# EAGLE design schema (EAGLE 6.5.0)
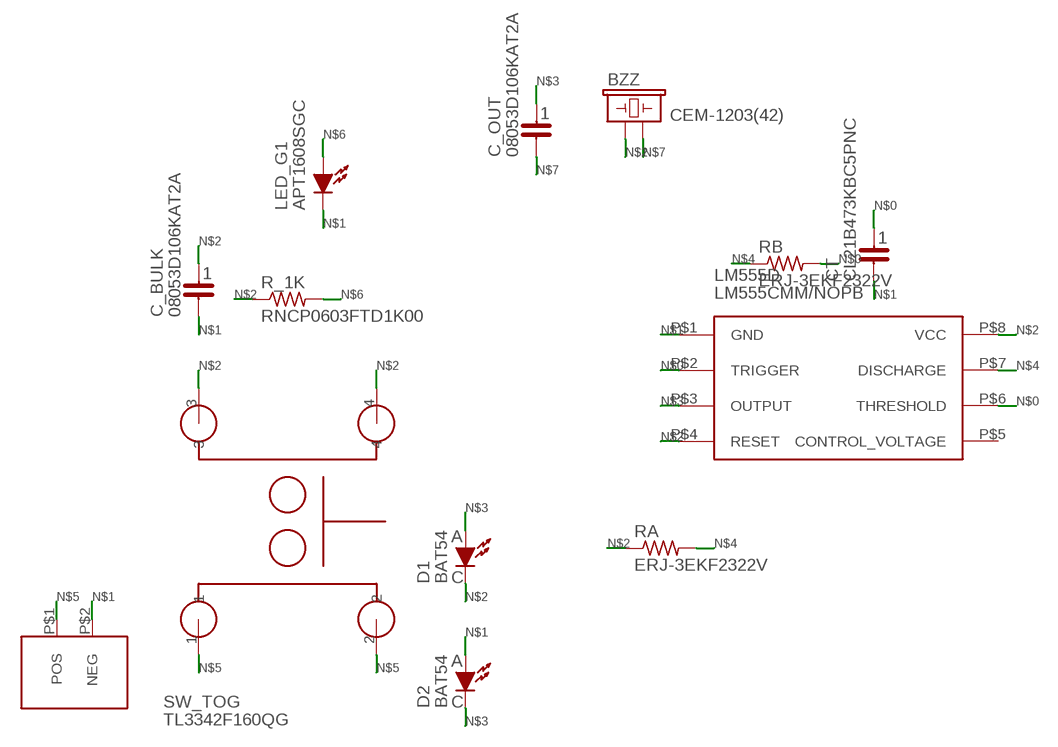
[diagram p0: schematic, sheet 1]

## Parts
BZZ  CEM-1203(42)  BUZZERPTH-KIT  [BUZZER-12MM-KIT]
C_BULK  08053D106KAT2A  C_0805  [C_0805]
C_OUT  08053D106KAT2A  C_0805  [C_0805]
CT  CL21B473KBC5PNC  C_0805  [C_0805]
D1  BAT54  [BAT54]
D2  BAT54  [BAT54]
FID1  FIDUCIAL1MM  [FIDUCIAL_1MM]  (not placed on a sheet)
FID2  FIDUCIAL1MM  [FIDUCIAL_1MM]  (not placed on a sheet)
FID3  FIDUCIAL1MM  [FIDUCIAL_1MM]  (not placed on a sheet)
FID4  FIDUCIAL1MM  [FIDUCIAL_1MM]  (not placed on a sheet)
FID5  FIDUCIAL1MM  [FIDUCIAL_1MM]  (not placed on a sheet)
FID6  FIDUCIAL1MM  [FIDUCIAL_1MM]  (not placed on a sheet)
J1_9V  BS6I  [1X2VIA]
LED_G1  APT1608SGC  LED-0603-KINGBRIGHT  [0603-LED-KINGBRIGHT]
LM555D  LM555CMM/NOPB  [S-PDSO-G8]
R_1K  RNCP0603FTD1K00  RESISTOR_0603  [R_0603]
RA  ERJ-3EKF2322V  RESISTOR_0603  [R_0603]
RB  ERJ-3EKF2322V  RESISTOR_0603  [R_0603]
SW_TOG  TL3342F160QG  [TL3342F160QG]

## Nets
N$0: CT.1 LM555D.P$2(TRIGGER) LM555D.P$6(THRESHOLD) RB.P$2
N$1: C_BULK.2 CT.2 D2.1(A) J1_9V.P$2(NEG) LED_G1.1(C) LM555D.P$1(GND)
N$2: BZZ.+ C_BULK.1 D1.3(C) LM555D.P$4(RESET) LM555D.P$8(VCC) R_1K.P$1 RA.P$1 SW_TOG.3 SW_TOG.4
N$3: C_OUT.1 D1.1(A) D2.3(C) LM555D.P$3(OUTPUT)
N$4: LM555D.P$7(DISCHARGE) RA.P$2 RB.P$1
N$5: J1_9V.P$1(POS) SW_TOG.1 SW_TOG.2
N$6: LED_G1.2(A) R_1K.P$2
N$7: BZZ.- C_OUT.2
Unconnected: LM555D.P$5(CONTROL_VOLTAGE)

## Library data of the parts
BZZ = SparkFun-Electromechanical:BUZZER; PROD_ID: COMP-08253
C_BULK C_OUT CT = mlcc:C_0805
D1 D2 = magic_man:BAT54
FID1-FID6 = adafruit:FIDUCIAL
J1_9V = General_Will:BS6I
LED_G1 = ecad:LED-0603-KINGBRIGHT
LM555D = ecad:LM555CMM/NOPB
R_1K RA RB = resistor:RESISTOR_0603
SW_TOG = TL3342F160QG-697586:TL3342F160QG

## Board
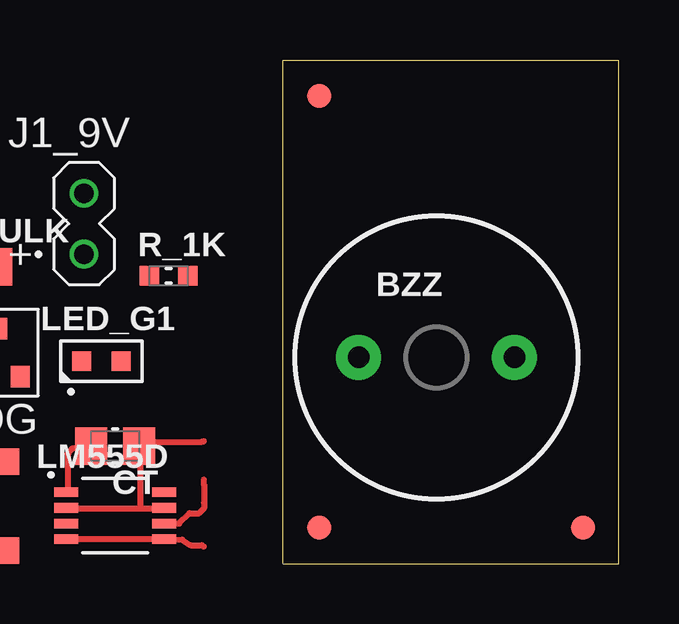
[diagram p1: board, top side]
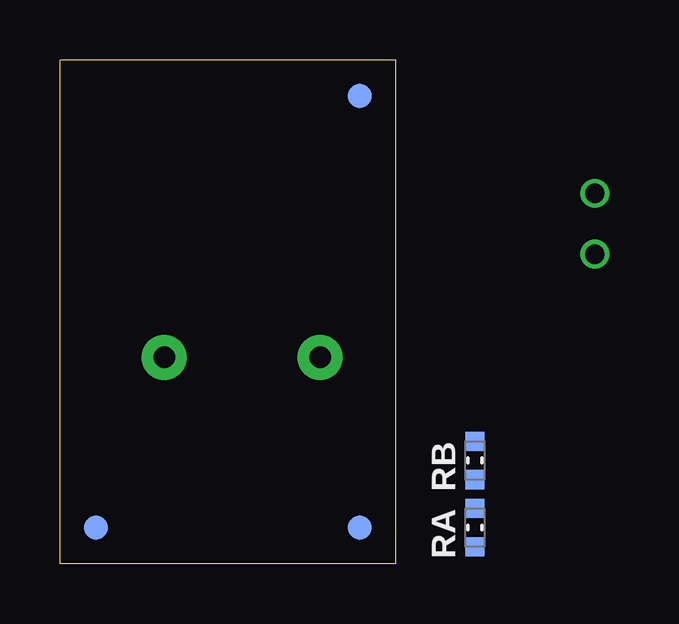
[diagram p2: board, bottom side, seen from below]

Size 14 x 21 mm. Coordinates in mm from the lower left corner, seen from the top.
Outline: 0,0 14,0 14,21 0,21 0,0
Copper layers (1*16): Top 0.035mm / dielectric 0.2mm / Bottom 0.035mm
Design rules "MacroFab_2_Layer": minimum track width 6mil, minimum drill 12mil, track to track 6mil, track to pad 6mil, pad to pad 6mil, via to via 6mil, smd to smd 0mil, copper to edge 10mil, drill to drill 10mil, minimum pad ring 6mil, minimum via ring 6mil, stop-mask expansion 2mil, vias tented up to drill 25mil, thermal gap 10mil

### Footprints (pad centres in the part's own frame; a part is rotated, then mirrored left to right if it is on the bottom)
BUZZER-12MM-KIT = drill 0.9 pad 1.88: + 3.25,0; - -3.25,0
C_0805 = smd 1.35 x 1.55: 1 -1,0; 2 1,0
BAT54 = smd 0.8 x 0.9: 1 -0.95,-1; 2 0.95,-1; 3 0,1
FIDUCIAL_1MM = smd 1 x 1: 1 0,0
1X2VIA = drill 0.8: P$1 0,0; P$2 0,2.54
0603-LED-KINGBRIGHT = smd 0.8 x 0.8: 1 -0.825,0; 2 0.825,0
S-PDSO-G8 = smd 1 x 0.4: P$1 -2.05,0.975; P$2 -2.05,0.325; P$3 -2.05,-0.325; P$4 -2.05,-0.975; P$5 2.05,0.975; P$6 2.05,0.325; P$7 2.05,-0.325; P$8 2.05,-0.975
R_0603 = smd 0.8 x 0.8: P$1 -0.8,0; P$2 0.8,0
TL3342F160QG = smd 1.8 x 1.1: 1 -3.1,-1.85; 2 3.1,-1.85; 3 -3.1,1.85; 4 3.1,1.85

### Placement (x,y rotation side)
BZZ  6.4,8.6 0 top
C_BULK  -12.97,12.38 0 top  (outside the outline)
C_OUT  -17.4,12.3 0 top  (outside the outline)
CT  -7,4.9 180 top  (outside the outline)
D1  -11.9,8.8 0 top  (outside the outline)
D2  -16.8,8.8 0 top  (outside the outline)
FID1  1.5,1.5 0 top
FID2  1.5,19.5 0 top
FID3  12.5,1.5 0 top
FID4  1.5,1.5 0 bottom
FID5  1.5,19.5 0 bottom
FID6  12.5,1.5 0 bottom
J1_9V  -8.3,12.9 0 top  (outside the outline)
LED_G1  -7.57,8.44 0 top  (outside the outline)
LM555D  -7,2 0 top  (outside the outline)
R_1K  -4.77,12 0 top  (outside the outline)
RA  -3.3,1.5 90 bottom  (outside the outline)
RB  -3.3,4.3 90 bottom  (outside the outline)
SW_TOG  -15,2.4 0 top  (outside the outline)

### Tracks (layer width: path | path; a pad name or v marks a point on that pad's centre or on a via)
N$0
  Top 0.254: RB.P$2 -3.4,5.08 -5.94,5.08 CT.1 -5.94,4.83 -5.94,2.29 | -5.94,2.29 -5.17,2.29 LM555D.P$6 | -5.94,2.29 -8.98,2.29 LM555D.P$2
N$1
  Top 0.254: LM555D.P$1 -8.98,3.05 -8.98,4.56 -8.8,4.8 -8.4,4.8 -8.22,4.83 CT.2
N$2
  Top 0.254: RA.P$1 -3.4,0.76 -3.87,0.76 -4.2,1 -4.92,1.02 LM555D.P$8 -5.17,1.02 -8.98,1.02 LM555D.P$4
N$4
  Top 0.254: RB.P$1 -3.3,3.3 -3.3,2.54 RA.P$2 -3.5,2.1 -3.9,2.1 -4.33,1.68 LM555D.P$7